# EAGLE design SterownikCNC4_1 (EAGLE 7.5.0)
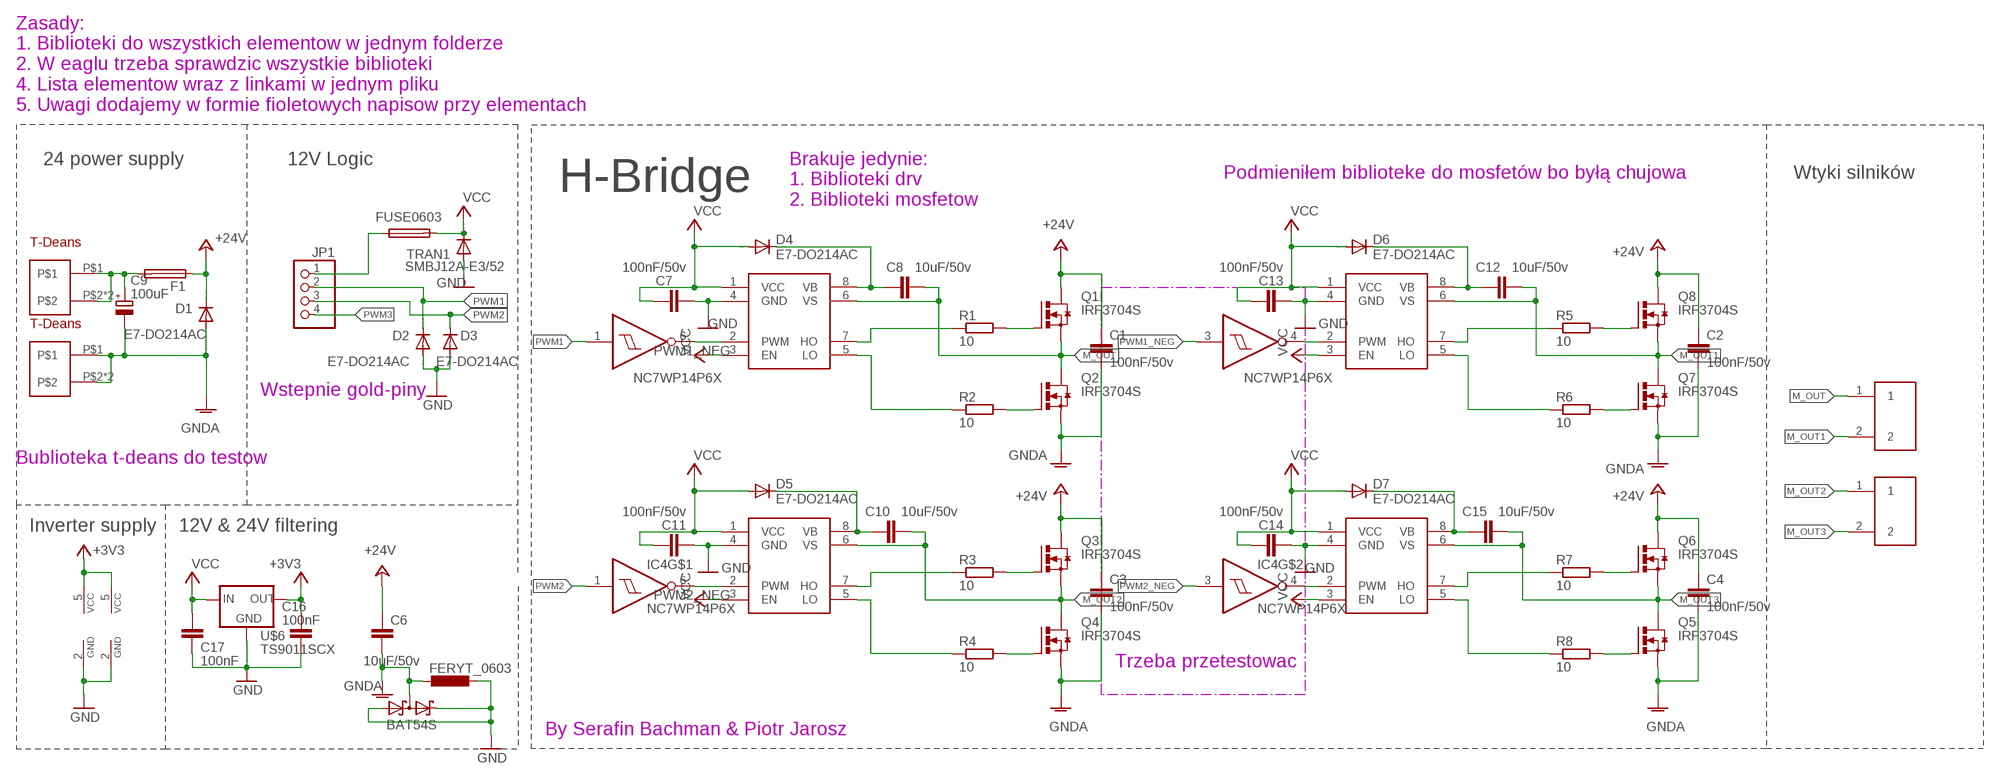
[diagram p0: schematic, sheet 1]

## Parts
C1  100nF/50v  C-EUC0603K  [C0603K]
C2  100nF/50v  C-EUC0603K  [C0603K]
C3  100nF/50v  C-EUC0603K  [C0603K]
C4  100nF/50v  C-EUC0603K  [C0603K]
C6  10uF/50v  C-EUC0603K  [C0603K]
C7  100nF/50v  C-EUC0603K  [C0603K]
C8  10uF/50v  C-EUC0603K  [C0603K]
C9  100uF  CPOL-EU153CLV-0810  [153CLV-0810]
C10  10uF/50v  C-EUC0603K  [C0603K]
C11  100nF/50v  C-EUC0603K  [C0603K]
C12  10uF/50v  C-EUC0603K  [C0603K]
C13  100nF/50v  C-EUC0603K  [C0603K]
C14  100nF/50v  C-EUC0603K  [C0603K]
C15  10uF/50v  C-EUC0603K  [C0603K]
C16  100nF  C-EUC0603K  [C0603K]
C17  100nF  C-EUC0603K  [C0603K]
D1  E7-DO214AC  [DO214AC]
D2  E7-DO214AC  [DO214AC]
D3  E7-DO214AC  [DO214AC]
D4  E7-DO214AC  [DO214AC]
D5  E7-DO214AC  [DO214AC]
D6  E7-DO214AC  [DO214AC]
D7  E7-DO214AC  [DO214AC]
D8  BAT54S  [SOT23]
F1  TE5  [TE5]
IC1  NC7WP14P6X  [SOT65P210X110-6AN_SC88_SC70-6]
IC4  NC7WP14P6X  [SOT65P210X110-6AN_SC88_SC70-6]
JP1  PINHD-1X4  [1X04]
Q1  IRF3704S  [D2PACK]
Q2  IRF3704S  [D2PACK]
Q3  IRF3704S  [D2PACK]
Q4  IRF3704S  [D2PACK]
Q5  IRF3704S  [D2PACK]
Q6  IRF3704S  [D2PACK]
Q7  IRF3704S  [D2PACK]
Q8  IRF3704S  [D2PACK]
R1  10  R-EU_R0603  [R0603]
R2  10  R-EU_R0603  [R0603]
R3  10  R-EU_R0603  [R0603]
R4  10  R-EU_R0603  [R0603]
R5  10  R-EU_R0603  [R0603]
R6  10  R-EU_R0603  [R0603]
R7  10  R-EU_R0603  [R0603]
R8  10  R-EU_R0603  [R0603]
TRAN1  SMBJ12A-E3/52  [DO214AA]
U1  IR2104  [SO08]
U2  IR2104  [SO08]
U3  IR2104  [SO08]
U4  IR2104  [SO08]
U$2  T-DEANS  [T-DEANS]
U$3  FUSE0603  [0603]
U$4  FERYT_0603  [R0603]
U$5  T-DEANS  [T-DEANS]
U$6  TS9011SCX  [SOT23]
U$7  PTB-02_5.08MM  [PTB-5.08MM-02]
U$9  PTB-02_5.08MM  [PTB-5.08MM-02]

## Nets
+3V3: C16.1 IC1.5(VCC) IC4.5(VCC) U$6.2(OUT)
+24V: C1.1 C2.1 C3.1 C4.1 C6.1 D1.C F1.1 Q1.2(D) Q3.2(D) Q6.2(D) Q8.2(D)
F2: JP1.1 U$3.1
GND: C7.2 C11.2 C13.2 C14.2 C16.2 C17.2 D2.A D3.A D8.1(A1) D8.2(C2) IC1.2(GND) IC4.2(GND) TRAN1.A U1.4(GND) U2.4(GND) U3.4(GND) U4.4(GND) U$4.2 U$6.1(GND)
GNDA: C1.2 C2.2 C3.2 C4.2 C6.2 C9.- D1.A D8.3(C1A2) Q2.3(S) Q4.3(S) Q5.3(S) Q7.3(S) U$4.1 U$5.P$1 U$5.P$2 U$5.P$3
M_OUT: C8.2 Q1.3(S) Q2.2(D) U1.6(VS) U$7.1
M_OUT1: C12.2 Q7.2(D) Q8.3(S) U2.6(VS) U$7.2
M_OUT2: C10.2 Q3.3(S) Q4.2(D) U3.6(VS) U$9.1
M_OUT3: C15.2 Q5.2(D) Q6.3(S) U4.6(VS) U$9.2
N$1: Q1.1(G) R1.2
N$2: Q2.1(G) R2.2
N$3: R1.1 U1.7(HO)
N$4: R2.1 U1.5(LO)
N$5: IC1.4(O) U2.2(PWM)
N$6: IC4.4(O) U4.2(PWM)
N$7: R5.1 U2.7(HO)
N$8: R6.1 U2.5(LO)
N$10: Q7.1(G) R6.2
N$11: Q8.1(G) R5.2
N$12: C10.1 D5.C U3.8(VB)
N$13: C9.+ F1.2 U$2.P$1 U$2.P$2 U$2.P$3
N$14: R3.1 U3.7(HO)
N$15: R4.1 U3.5(LO)
N$16: Q4.1(G) R4.2
N$17: Q3.1(G) R3.2
N$18: C15.1 D7.C U4.8(VB)
N$20: R7.1 U4.7(HO)
N$21: R8.1 U4.5(LO)
N$22: Q5.1(G) R8.2
N$23: Q6.1(G) R7.2
N$49: C8.1 D4.C U1.8(VB)
N$51: C12.1 D6.C U2.8(VB)
PWM1: D2.C IC1.1(I) JP1.2
PWM1_NEG: IC1.3(I) IC1.6(O) U1.2(PWM)
PWM2: D3.C IC4.1(I) JP1.3
PWM2_NEG: IC4.3(I) IC4.6(O) U3.2(PWM)
PWM3: JP1.4
VCC: C7.1 C11.1 C13.1 C14.1 C17.1 D4.A D5.A D6.A D7.A TRAN1.C U1.1(VCC) U1.3(EN) U2.1(VCC) U2.3(EN) U3.1(VCC) U3.3(EN) U4.1(VCC) U4.3(EN) U$3.2 U$6.3(IN)

## Notes on the sheet
- Zasady:
  1. Biblioteki do wszystkich elementow w jednym folderze
  2. W eaglu trzeba sprawdzic wszystkie biblioteki 
  4. Lista elementow wraz z linkami w jednym pliku
  5. Uwagi dodajemy w formie fioletowych napisow przy elementach
- 24 power supply | 12V Logic
- Podmieniłem biblioteke do mosfetów bo byłą chujowa | Wtyki silników
- H-Bridge
- Brakuje jedynie:
  1. Biblioteki drv
  2. Biblioteki mosfetow
- Wstepnie gold-piny
- Bublioteka t-deans do testow
- Inverter supply | 12V & 24V filtering
- Trzeba przetestowac
- By Serafin Bachman & Piotr Jarosz

## Library data of the parts
C1-C4 C6-C8 C10-C17 = rcl:C-EU: CAPACITOR, European symbol
C9 = rcl:CPOL-EU: POLARIZED CAPACITOR, European symbol
D1-D7 = diode:E7-DO214AC
D8 = diode:BAT54S: Schottky Diodes Pin connection corrected 2011-05-04 Source: Fairchild .. BAT54.pdf
F1 = fuse:TE5: FUSE Wickmann; OC_FARNELL: unknown; OC_NEWARK: unknown
IC1 IC4 = bufory,invertery:NC7W*14
JP1 = pinhead:PINHD-1X4: PIN HEADER
Q1-Q8 = transistor-power:IRF3704: SMPS MOSFET HEXFET® Power MOSFET Source: http://www.irf.com/product-info/datasheets/data/irf3704.pdf
R1-R8 = rcl:R-EU_: RESISTOR, European symbol
TRAN1 = diode:SMBJ12A-E3/52
U1-U4 = robione:IR2104
U$2 U$5 = Conector_T-deans:T-DEANS
U$3 = fuse:FUSE0603
U$4 = rcl:FERYT_0603
U$6 = v-reg:TS9011SCX
U$7 U$9 = robione:PTB-02

## Board
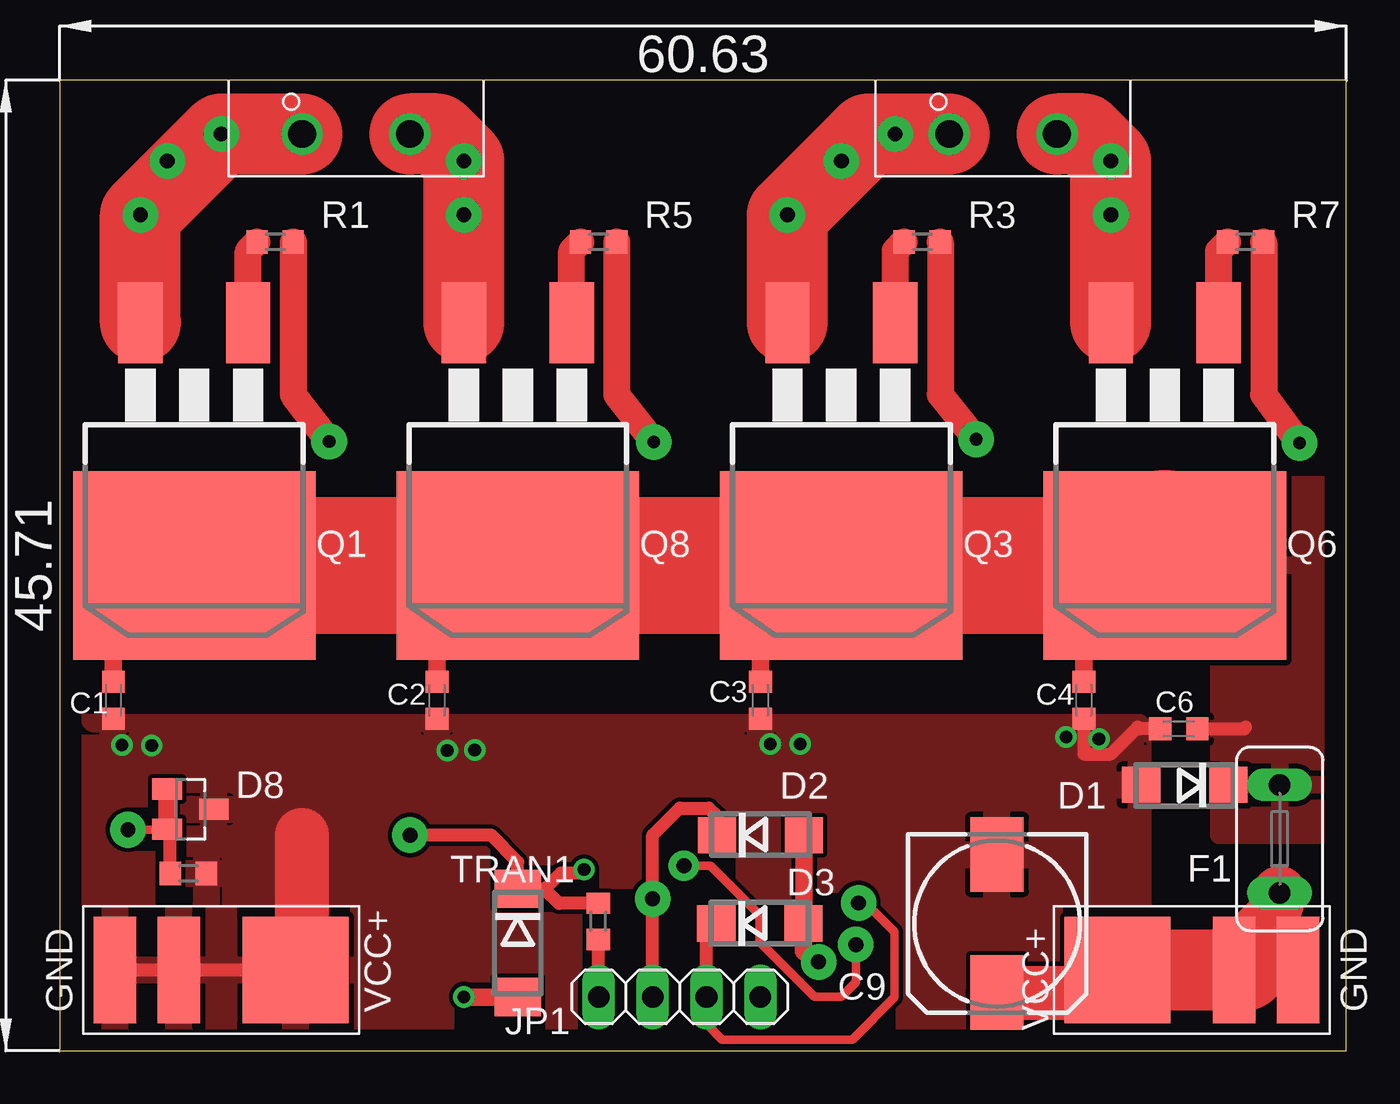
[diagram p1: board, top side]
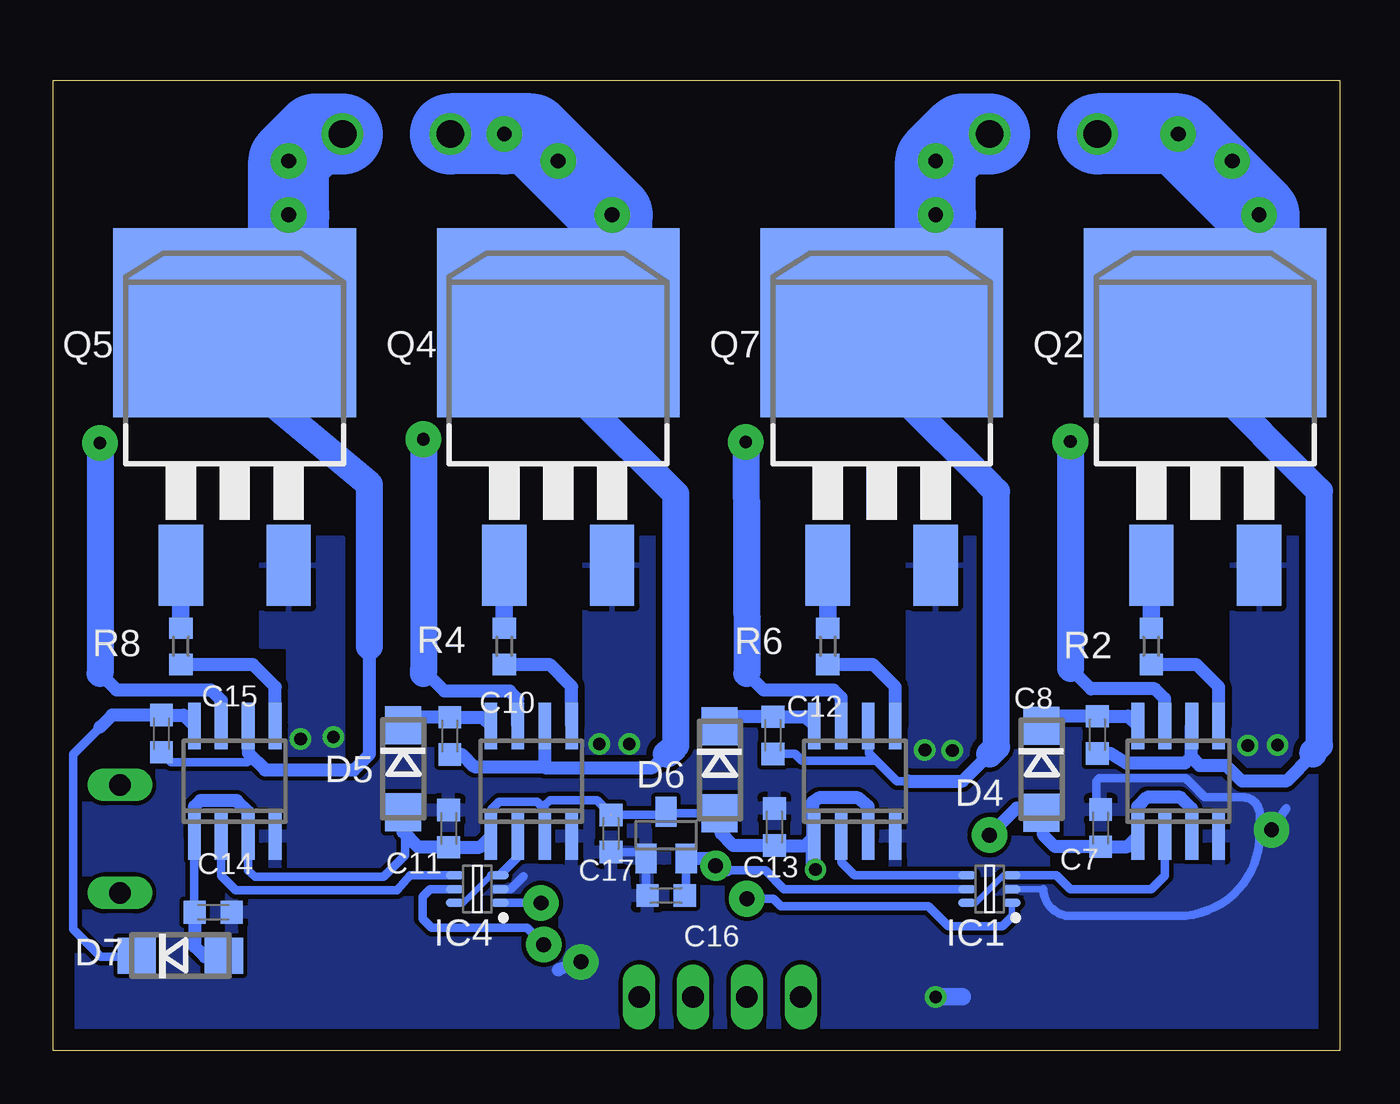
[diagram p2: board, bottom side, seen from below]

Size 60.63 x 45.71 mm. Coordinates in mm from the lower left corner, seen from the top.
Outline: 0,0 60.63,0 60.63,45.71 0,45.71 0,0
Copper layers (1*16): Top 0.035mm / dielectric 1.5mm / Bottom 0.035mm
Design rules "default": minimum track width 10mil, minimum drill 24mil, track to track 8mil, track to pad 8mil, pad to pad 8mil, via to via 8mil, smd to smd 8mil, copper to edge 40mil, drill to drill 8mil, minimum pad ring 10mil, minimum via ring 8mil, stop-mask expansion 4mil, vias tented up to drill 0mil, thermal gap 10mil

### Footprints (pad centres in the part's own frame; a part is rotated, then mirrored left to right if it is on the bottom)
C0603K = smd 1.05 x 1.08: 1 -0.875,0; 2 0.875,0
153CLV-0810 = smd 3.5 x 2.5: + 3.25,0; - -3.25,0
DO214AC = smd 1.8 x 1.7: A 2.05,0; C -2.05,0
SOT23 = smd 1 x 1.4: 1 -0.95,-1.1; 2 0.95,-1.1; 3 0,1.1
TE5 = drill 1.016 long: 1 -2.54,0; 2 2.54,0
SOT65P210X110-6AN_SC88_SC70-6 = smd 0.85 x 0.4: 1 -1.05,0.65; 2 -1.05,0; 3 -1.05,-0.65; 4 1.05,-0.65; 5 1.05,0; 6 1.05,0.65
1X04 = drill 1.016 long: 1 -3.81,0; 2 -1.27,0; 3 1.27,0; 4 3.81,0
D2PACK = smd 2.083 x 3.81: 1 -2.54,-8.89; 3 2.54,-8.89 | smd 11.43 x 8.89: 2 0,2.54
R0603 = smd 1 x 1.1: 1 -0.85,0; 2 0.85,0
DO214AA = smd 1.8 x 2.2: A 2.55,0; C -2.55,0
SO08 = smd 0.6 x 2.2: 1 -1.905,-2.6; 2 -0.635,-2.6; 3 0.635,-2.6; 4 1.905,-2.6; 5 1.905,2.6; 6 0.635,2.6; 7 -0.635,2.6; 8 -1.905,2.6
T-DEANS = smd 5 x 5: P$1 0,-3.5 | smd 5 x 2: P$2 0,2; P$3 0,5
0603 = smd 1 x 1.1: 1 -0.85,0; 2 0.85,0
PTB-5.08MM-02 = drill 1.3: 1 -2.54,0; 2 2.54,0

### Placement (x,y rotation side)
C1  2.54,16.51 270 top
C2  17.78,16.51 270 top
C3  33.02,16.51 270 top
C4  48.26,16.51 270 top
C6  52.73,15.16 180 top
C7  11.28,10.49 90 bottom
C8  11.43,14.88 270 bottom
C9  44.17,5.99 270 top
C10  41.94,14.83 270 bottom
C11  41.99,10.46 90 bottom
C12  26.72,14.86 270 bottom
C13  26.64,10.54 90 bottom
C14  53.09,6.53 0 bottom
C15  55.52,14.94 270 bottom
C16  31.75,7.32 180 bottom
C17  34.34,10.24 270 bottom
D1  53.01,12.52 180 top
D2  33.02,10.16 0 top
D3  32.99,5.99 0 top
D4  14.07,13.26 270 bottom
D5  44.15,13.28 270 bottom
D6  29.24,13.23 270 bottom
D7  54.64,4.47 0 bottom
D8  6.17,11.38 270 top
F1  57.48,9.98 270 top
IC1  16.51,7.62 180 bottom
IC4  40.64,7.62 180 bottom
JP1  29.21,2.54 0 top
Q1  6.35,25.4 180 top
Q2  6.35,31.75 0 bottom
Q3  36.83,25.4 180 top
Q4  36.83,31.75 0 bottom
Q5  52.07,31.75 0 bottom
Q6  52.07,25.4 180 top
Q7  21.59,31.75 0 bottom
Q8  21.59,25.4 180 top
R1  10.16,38.1 180 top
R2  8.89,19.05 90 bottom
R3  40.64,38.1 180 top
R4  39.37,19.05 90 bottom
R5  25.4,38.1 180 top
R6  24.13,19.05 90 bottom
R7  55.88,38.1 180 top
R8  54.61,19.05 90 bottom
TRAN1  21.59,5.08 270 top
U1  7.62,12.7 0 bottom
U2  22.86,12.7 0 bottom
U3  38.1,12.7 0 bottom
U4  52.07,12.7 0 bottom
U$2  53.34,3.81 270 top
U$3  25.37,6.1 90 top
U$4  6.07,8.36 180 top
U$5  7.62,3.81 90 top
U$6  31.75,10.16 0 bottom
U$7  13.97,43.18 0 top
U$9  44.45,43.18 0 top

### Tracks (layer width: path | path; a pad name or v marks a point on that pad's centre or on a via)
+3V3  (via drill 0.7 pad 1.42, 0.7 pad 1.68)
  Top 0.406: 37.31,5 v37.52,5 37.52,3.23 36.83,2.54 35.56,2.54 32.97,5.13 32.97,6.3 33.02,6.35 30.66,8.71 v29.41,8.71
  Top 0.61: v29.41,8.71 29.39,8.71 29.21,8.89
  Bottom 0.406: U$6.2 30.8,7.39 C16.1 30.85,7.34 | IC1.5 26.19,7.62 27.08,8.51 28.88,8.51 | IC4.5 42.88,7.62 43.23,7.26 43.23,6.22 42.8,5.79 38.3,5.79 v37.52,5
  Bottom 0.61: U$6.2 29.76,9.06 v29.41,8.71 29.21,8.51 28.88,8.51
+24V
  Top 0.61: C6.1 55.8,15.16 55.88,15.24
  Top 0.813: C1.1 2.54,21.59 3.81,22.86 Q1.2 | C2.1 17.78,22.86 | C3.1 33.02,20.32 35.56,22.86 | C4.1 48.26,20.32 50.8,22.86
  Top 6.452: Q1.2 17.78,22.86 Q8.2 35.56,22.86 Q3.2 50.8,22.86 Q6.2 52.07,24.13
  pour Top: 54.61,26.67 60.96,26.67 60.96,10.16 54.61,10.16
F2
  Top 0.61: JP1.1 25.4,5.22 U$3.1
GND  (via drill 0.6 pad 0.61, 0.7 pad 1.68)
  Top 0.406: 5.22,10.28 arc-90 5.18,10.41 v3.23,10.41
  Top 0.61: U$4.2 5.22,10.28 D8.2 | 21.57,2.5 TRAN1.A
  Top 0.813: D8.2 D8.1 | TRAN1.A v19.06,2.53 v19.05,2.54 | D2.A 35.07,6.1 D3.A 35.05,4.68 v35.76,4.19
  Bottom 0.305: IC1.2 13.97,7.62
  Bottom 0.406: C16.2 32.7,7.39 U$6.1 33,9.36 C17.2 | v3.23,10.41 2.54,11.43 | 13.97,7.62 arc-90 12.7,6.35 7.62,6.35 arc-90 3.79,10.19 3.79,11.15 arc-90 4.57,11.94 6.38,11.94 7.26,12.83 11.35,12.83 11.48,12.7 11.48,11.57 C7.2 | IC4.2 39.06,7.62 38.46,8.23
  Bottom 0.61: v35.76,4.19 36.83,3.81
  Bottom 0.813: v19.05,2.54 17.78,2.54
  pour Bottom: 1.27,16.51 60.96,16.51 60.96,0 1.27,0
GNDA  (via drill 0.6 pad 0.61)
  Top 0.61: U$5.P$3 10.16,3.81 11.43,5.08 | C6.2 50.88,15.16 50.8,15.24 49.53,13.97 48.26,13.97 C4.2
  Top 2.54: 11.43,5.08 11.43,10.16
  other vias: 4.34,14.38 2.95,14.4 18.26,14.15 19.56,14.17 33.48,14.45 34.9,14.45 47.42,14.78 48.97,14.68
  pour Top: 1.27,15.24 50.8,15.24 50.8,1.27 1.27,1.27
  pour Bottom (isolate 0.305): 1.27,24.13 1.27,12.7 5.08,12.7 5.08,24.13
  pour Bottom (isolate 0.305): 16.51,24.13 16.51,12.7 20.32,12.7 20.32,24.13
  pour Bottom (isolate 0.305): 31.75,24.13 31.75,12.7 35.56,12.7 35.56,24.13
  pour Bottom (isolate 0.305): 46.99,12.7 49.53,12.7 49.53,19.05 50.8,19.05 50.8,24.13 46.99,24.13
M_OUT  (via drill 0.7 pad 1.68)
  Top 3.81: Q1.3 v3.81,39.37 v7.62,43.18 U$7.1
  Bottom 0.61: 1.27,13.97 2.54,12.7 4.62,12.7 5.36,13.44 6.6,13.44 7.01,13.84 | C8.2 10.81,14.01 10.08,13.56 7.29,13.56 7.01,13.84 | 7.01,13.84 7.01,15.28 U1.6
  Bottom 1.27: Q2.2 7.62,34.29 6.35,33.02 6.35,31.75 0.96,26.36 0.96,14.38 1.27,14.07 1.27,13.97
  Bottom 3.81: Q2.2 3.81,36.83 v3.81,39.37 v7.62,43.18 U$7.1
M_OUT1  (via drill 0.7 pad 1.68)
  Top 3.81: Q8.3 v19.05,39.37 v19.05,41.91 17.78,43.18 U$7.2
  Bottom 0.406: 20.32,12.7 20.88,12.7 21.84,13.66 | 21.84,13.66 22.2,14.02 22.2,15.28 U2.6 | C12.2 25.67,13.98 25.35,13.66 21.84,13.66
  Bottom 0.61: 20.32,12.7 17.78,12.7 16.51,13.97
  Bottom 1.27: Q7.2 20.32,33.02 20.32,30.48 16.74,26.9 16.51,26.67 16.18,26.34 16.18,14.3 16.51,13.97
  Bottom 3.81: Q7.2 19.05,36.83 v19.05,39.37 v19.05,41.91 17.78,43.18 U$7.2
M_OUT2  (via drill 0.7 pad 1.68)
  Top 3.81: Q3.3 v34.29,39.37 v36.83,41.91 38.1,43.18 v39.37,43.18 U$9.1
  Bottom 0.61: U3.6 37.47,13.34 | C10.2 41.37,13.96 40.79,13.39 37.52,13.39 37.47,13.34 | 37.47,13.34 32.38,13.34 31.75,13.97
  Bottom 1.27: Q4.2 35.56,33.02 35.56,30.48 31.29,26.21 31.29,14.38 31.7,13.97 31.75,13.97
  Bottom 3.81: Q4.2 34.29,36.83 v34.29,39.37 v36.83,41.91 38.1,43.18 v39.37,43.18 U$9.1
M_OUT3  (via drill 0.7 pad 1.68)
  Top 3.81: Q6.3 v49.53,39.37 v49.53,41.91 48.26,43.18 U$9.2
  Bottom 0.406: 51.44,14.02 51.44,13.64 51.49,13.59 55.05,13.59 C15.2
  Bottom 0.61: 45.72,19.05 45.72,13.97 46.46,13.23 50.65,13.23 51.44,14.02 U4.6
  Bottom 1.27: 45.72,19.05 45.72,26.67 53.34,33.02 Q5.2
  Bottom 3.81: Q5.2 49.53,36.83 v49.53,39.37 v49.53,41.91 48.26,43.18 U$9.2
N$1
  Top 1.27: Q1.1 8.89,37.68 R1.2
N$2
  Bottom 0.813: R2.2 Q2.1
N$3  (via drill 0.6 pad 1.68)
  Top 1.27: R1.1 11.01,30.9 v12.7,28.7
  Bottom 0.61: U1.7 8.26,16.59 8.71,17.04 11.73,17.04 12.7,18.01
  Bottom 1.27: v12.7,28.7 12.7,18.01
N$4
  Bottom 0.61: U1.5 5.71,17.14 6.77,18.2 R2.1
N$5
  Bottom 0.406: U2.2 23.5,8.89 22.88,8.27 IC1.4
N$6
  Bottom 0.406: U4.2 52.7,8.26 52.02,7.57 44.42,7.57 43.8,8.27 IC4.4
N$7  (via drill 0.6 pad 1.68)
  Top 1.27: R5.1 26.25,30.9 v27.99,28.68
  Bottom 0.61: U2.7 23.5,16.64 23.85,16.99 27.15,16.99 27.94,17.78
  Bottom 1.27: v27.99,28.68 27.94,17.78
N$8
  Bottom 0.61: U2.5 20.95,17.14 22.01,18.2 R6.1
N$9  (via drill 0.7 pad 1.68)
  other vias: 5.08,41.91
N$10
  Bottom 0.813: R6.2 Q7.1
N$11
  Top 1.27: Q8.1 24.13,37.68 R5.2
N$12
  Bottom 0.61: D5.C 43.77,15.71 C10.1 40.41,15.71 U3.8
N$13
  Top 0.254: U$2.P$3 U$2.P$2 55.88,3.81
  Top 2.54: 51.11,3.81 U$2.P$1 50.04,2.74 C9.+ | F1.2 57.15,6.35 54.61,3.81
  Top 3.81: U$2.P$1 54.61,3.81 55.88,3.81
N$14  (via drill 0.6 pad 1.68)
  Top 1.27: R3.1 41.49,30.9 v43.18,28.8
  Bottom 0.61: U3.7 38.73,16.56 39.12,16.94 42.19,16.94 43.18,17.93
  Bottom 1.27: v43.18,28.8 43.18,17.93 43.18,17.78
N$15
  Bottom 0.61: U3.5 36.2,17.14 37.25,18.2 R4.1
N$16
  Bottom 0.813: R4.2 Q4.1
N$17
  Top 1.27: Q3.1 39.37,37.68 R3.2
N$18
  Bottom 0.406: 58.36,15.3 58.42,15.24 59.69,13.97 59.69,5.71 58.4,4.42 56.74,4.42 D7.C
  Bottom 0.61: 58.42,15.24 57.85,15.81 C15.1 54.48,15.81 U4.8
N$20  (via drill 0.6 pad 1.68)
  Top 1.27: R7.1 56.73,30.9 v58.42,28.63
  Bottom 0.61: U4.7 52.7,16.51 53.19,16.99 57.63,16.99 58.42,17.78
  Bottom 1.27: v58.42,28.63 58.42,17.78
N$21
  Bottom 0.61: U4.5 50.16,17.14 51.22,18.2 R8.1
N$22
  Bottom 0.813: R8.2 Q5.1
N$23
  Top 1.27: Q6.1 54.61,37.68 R7.2
N$49
  Bottom 0.61: U1.8 9.98,15.76 C8.1 13.62,15.76 D4.C
N$51
  Bottom 0.61: D6.C 28.79,15.73 C12.1 25.2,15.73 U2.8
PWM1  (via drill 0.7 pad 1.68)
  Top 0.61: JP1.2 v27.94,7.16 27.94,10.16 29.21,11.43 30.58,11.43 30.99,11.02 30.99,10.18 D2.C
  Bottom 0.305: IC1.1 15.46,6.31
  Bottom 0.406: 15.46,6.31 15.9,5.87 18.44,5.87 19.38,6.81 26.34,6.81 26.7,7.16 v27.94,7.16
PWM1_NEG
  Bottom 0.305: IC1.3 15.47,8.26 15.88,8.26 17.16,6.97 IC1.6
  Bottom 0.406: U1.2 8.26,8.26 8.89,7.62 12.7,7.62 13.35,8.27 IC1.3
PWM2  (via drill 0.7 pad 1.68)
  Top 0.406: 30.97,5.98 D3.C 30.48,6.35 | 30.97,5.98 30.61,5.61 | 30.97,5.98 30.97,5.57 30.48,5.08 | v37.64,6.96 38,6.96 39.34,5.61 39.34,2.52 37.36,0.53 31.22,0.53 30.48,1.27 JP1.3
  Top 0.61: 30.48,5.86 D3.C 30.48,5.12 30.48,5.08 JP1.3
  Bottom 0.406: 39.58,6.99 IC4.1 37.65,6.97 v37.64,6.96
PWM2_NEG
  Bottom 0.305: IC4.6 41.29,6.97 39.99,8.27
  Bottom 0.406: U3.2 38.73,9.12 IC4.3 39.99,8.27
VCC  (via drill 0.6 pad 0.61, 0.7 pad 1.68)  (1 unrouted)
  Top 0.61: U$3.2 23.53,6.95 22.86,7.62 | 22.86,7.62 TRAN1.C 21.59,8.89 20.32,10.16 v16.51,10.16 | 22.86,7.62 23.62,8.38 24.56,8.38 v24.71,8.53
  Bottom 0.406: D6.A 31.34,11.18 31.75,10.77 U$6.3 31.9,11.11 C17.1 | 34.31,11.12 35,11.81 37.21,11.81 37.47,11.56 U3.3 37.47,11.38 37.82,11.73 39.62,11.73 40.01,11.35 U3.1 | 44.21,11.3 D5.A 44.04,11.13 44.04,9.22 45.06,8.2 51.1,8.2 51.44,8.48 51.44,11.25 | 13.97,10.16 13.97,11.43 | U4.1 53.98,6.54 C14.1
  Bottom 0.61: 43.64,10.73 43.77,10.86 | 43.77,10.86 D5.A | 13.57,10.71 D4.A 13.97,11.11 13.97,10.16 13.43,9.62 C7.1 10.01,9.62 U1.1 9.53,11.51 9.09,11.94 7.52,11.94 6.99,11.4 U1.3 | 28.71,10.65 D6.A 29.16,11.11 29.16,10.24 28.59,9.67 C13.1 25.2,9.67 U2.1 | U2.3 22.23,11.51 22.71,11.91 24.56,11.91 24.84,11.71 24.84,10.02 | 24.84,10.18 U2.1 | v24.71,8.53 24.84,8.61 24.84,10.02 | 24.84,10.02 U2.1 | 13.97,11.43 15.24,11.43 v16.51,10.16 | U3.1 40.52,9.59 C11.1 43.42,9.59 44.15,10.31 44.15,10.49 43.77,10.86 | U4.3 51.44,11.25 51.97,11.79 53.7,11.79 53.98,11.51 U4.1 | C14.1 53.96,4.91 53.47,4.42 52.64,4.42 D7.A

### Text on the board
OrgLBR: Czy tych złącz nie da się ścisnąć? | To Do: | Sprawdzić: / 1. Kondensator polimerowy / 2. Bezpiecznik +24V | Napisy w bibliotece t-deans | Dodać biblioteke zlacz silnika